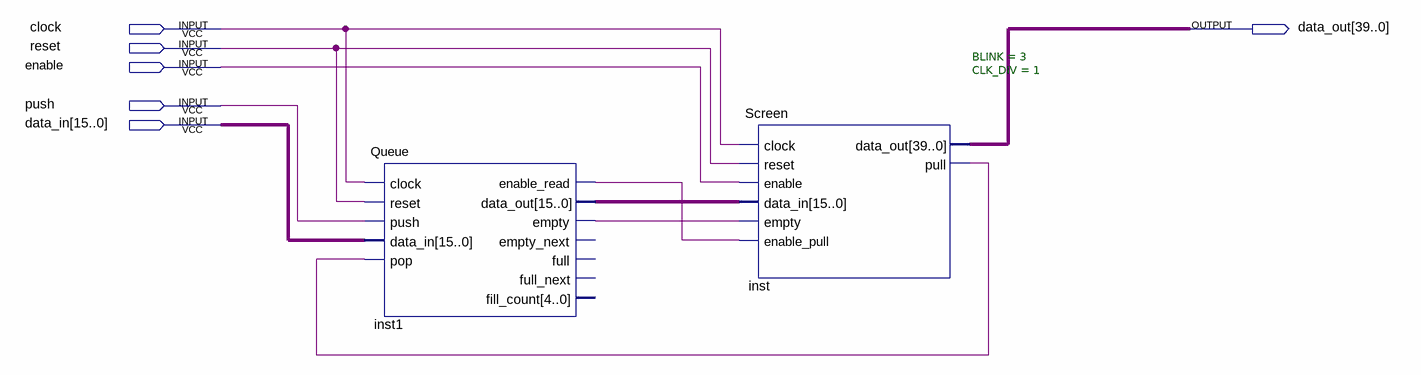
[diagram p0: schematic sheet]
// Quartus schematic TheScreen.bdf as structural Verilog: 2 symbols, 6 pins
module TheScreen (
  input  clock,
  input  reset,
  input  enable,
  input  push,
  input  [15:0] data_in,
  output [39:0] data_out
);

  wire inst1_empty, inst1_enable_read, inst_pull;
  wire [15:0] inst1_data_out;

  Queue inst1 (
    .clock(clock), .reset(reset), .push(push), .data_in(data_in), .pop(inst_pull),
    .enable_read(inst1_enable_read), .data_out(inst1_data_out), .empty(inst1_empty));  // open: empty_next, full, full_next, fill_count
  Screen #(.BLINK(3), .CLK_DIV(1)) inst (
    .clock(clock), .reset(reset), .enable(enable), .data_in(inst1_data_out), .empty(inst1_empty),
    .enable_pull(inst1_enable_read), .data_out(data_out), .pull(inst_pull));
endmodule
